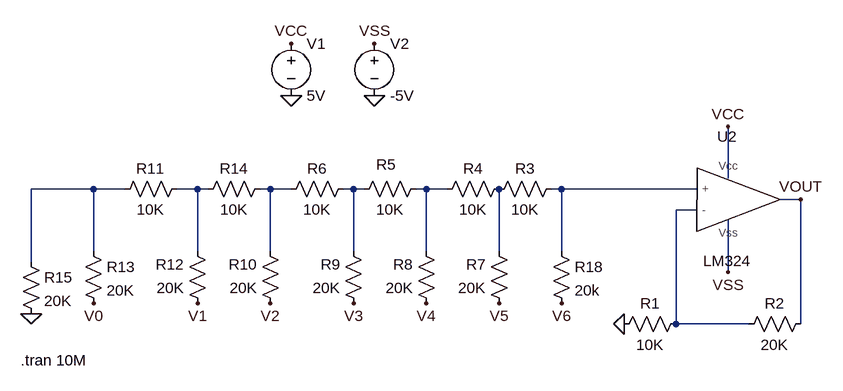
[diagram p0: schematic BAI 8 CHUAN BI 1.asc]
BAI 8 CHUAN BI 1.asc, the LTspice schematic file:
Version 4.1
SHEET 1 880 680
WIRE 256 80 256 0
WIRE -720 96 -816 96
WIRE -672 96 -720 96
WIRE -560 96 -592 96
WIRE -544 96 -560 96
WIRE -448 96 -464 96
WIRE -416 96 -448 96
WIRE -320 96 -336 96
WIRE -304 96 -320 96
WIRE -208 96 -224 96
WIRE -176 96 -208 96
WIRE 0 96 -16 96
WIRE 208 96 0 96
WIRE 368 112 336 112
WIRE 208 128 176 128
WIRE -720 192 -720 96
WIRE -560 192 -560 96
WIRE -448 192 -448 96
WIRE -320 192 -320 96
WIRE -208 192 -208 96
WIRE -96 192 -96 96
WIRE 0 192 0 96
WIRE -816 208 -816 96
WIRE 256 224 256 144
WIRE 176 304 176 128
WIRE 288 304 176 304
WIRE 368 304 368 112
FLAG 256 0 VCC
FLAG 256 224 VSS
FLAG 368 112 VOUT
FLAG 96 304 0
FLAG 0 272 V6
FLAG -96 272 V5
FLAG -208 272 V4
FLAG -320 272 V3
FLAG -448 272 V2
FLAG -560 272 V1
FLAG -816 288 0
FLAG -720 272 V0
FLAG -416 -128 VCC
FLAG -288 -128 VSS
FLAG -416 -48 0
FLAG -288 -48 0
SYMBOL res 384 288 R90
WINDOW 0 0 56 VBottom 2
WINDOW 3 32 56 VTop 2
SYMATTR InstName R2
SYMATTR Value 20K
SYMBOL res 192 288 R90
WINDOW 0 0 56 VBottom 2
WINDOW 3 32 56 VTop 2
SYMATTR InstName R1
SYMATTR Value 10K
SYMBOL res 0 80 R90
WINDOW 0 0 56 VBottom 2
WINDOW 3 32 56 VTop 2
SYMATTR InstName R3
SYMATTR Value 10K
SYMBOL res -80 80 R90
WINDOW 0 0 56 VBottom 2
WINDOW 3 32 56 VTop 2
SYMATTR InstName R4
SYMATTR Value 10K
SYMBOL res -208 80 R90
WINDOW 0 -6 62 VBottom 2
WINDOW 3 32 56 VTop 2
SYMATTR InstName R5
SYMATTR Value 10K
SYMBOL res -320 80 R90
WINDOW 0 0 56 VBottom 2
WINDOW 3 32 56 VTop 2
SYMATTR InstName R6
SYMATTR Value 10K
SYMBOL res -448 80 R90
WINDOW 0 0 56 VBottom 2
WINDOW 3 32 56 VTop 2
SYMATTR InstName R14
SYMATTR Value 10K
SYMBOL res -16 176 R0
SYMATTR InstName R18
SYMATTR Value 20k
SYMBOL res -80 288 R180
WINDOW 0 36 76 Left 2
WINDOW 3 36 40 Left 2
SYMATTR InstName R7
SYMATTR Value 20K
SYMBOL res -192 288 R180
WINDOW 0 36 76 Left 2
WINDOW 3 36 40 Left 2
SYMATTR InstName R8
SYMATTR Value 20K
SYMBOL res -304 288 R180
WINDOW 0 36 76 Left 2
WINDOW 3 36 40 Left 2
SYMATTR InstName R9
SYMATTR Value 20K
SYMBOL res -432 288 R180
WINDOW 0 36 76 Left 2
WINDOW 3 36 40 Left 2
SYMATTR InstName R10
SYMATTR Value 20K
SYMBOL res -688 112 R270
WINDOW 0 32 56 VTop 2
WINDOW 3 0 56 VBottom 2
SYMATTR InstName R11
SYMATTR Value 10K
SYMBOL res -544 288 R180
WINDOW 0 36 76 Left 2
WINDOW 3 36 40 Left 2
SYMATTR InstName R12
SYMATTR Value 20K
SYMBOL res -736 176 R0
SYMATTR InstName R13
SYMATTR Value 20K
SYMBOL res -832 192 R0
SYMATTR InstName R15
SYMATTR Value 20K
SYMBOL LM324 256 112 R0
SYMATTR InstName U2
SYMBOL voltage -416 -144 R0
WINDOW 123 0 0 Left 0
WINDOW 39 0 0 Left 0
SYMATTR InstName V1
SYMATTR Value 5V
SYMBOL voltage -288 -144 R0
WINDOW 123 0 0 Left 0
WINDOW 39 0 0 Left 0
SYMATTR InstName V2
SYMATTR Value -5V
TEXT -832 360 Left 2 !.tran 10M

The netlist it stands for:
* BAI 8 CHUAN BI 1.asc
R2 VOUT N007 20K
R1 N007 0 10K
R3 N006 N008 10K
R4 N008 N005 10K
R5 N005 N004 10K
R6 N004 N003 10K
R14 N003 N002 10K
R18 N006 V6 20k
R7 V5 N008 20K
R8 V4 N005 20K
R9 V3 N004 20K
R10 V2 N003 20K
R11 N001 N002 10K
R12 V1 N002 20K
R13 N001 V0 20K
R15 N001 0 20K
X§U2 N006 N007 VCC VSS VOUT LM324  ; pins + - Vcc Vss ?
V1 VCC 0 5V
V2 VSS 0 -5V
.tran 10M
.lib E:\ThiThucHanhCoHa\CoHa\LM324.cir
.backanno
.end